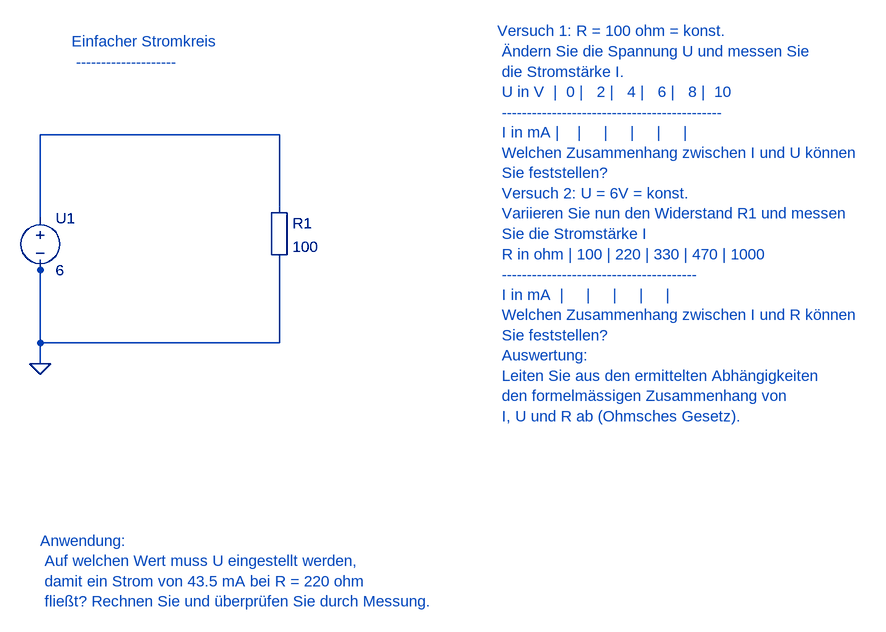
[diagram p0: schematic 1_1_1_Stromkreis.asc]
1_1_1_Stromkreis.asc, the LTspice schematic file:
Version 4
SHEET 1 880 680
WIRE 160 480 160 464
WIRE 160 624 160 592
WIRE 160 592 160 464
WIRE 528 464 528 592
WIRE 528 592 160 592
WIRE 528 384 528 272
WIRE 528 272 160 272
WIRE 160 272 160 400
FLAG 160 624 0
SYMBOL voltage 160 384 R0
SYMATTR InstName U1
SYMATTR Value 6
SYMBOL Misc\EuropeanResistor 512 368 R0
SYMATTR InstName R1
SYMATTR Value 100
TEXT 208 128 Left 2 ;Einfacher Stromkreis \n --------------------
TEXT 864 112 Left 2 ;Versuch 1: R = 100 ohm = konst. \n Ändern Sie die Spannung U und messen Sie \n die Stromstärke I. \n U in V  |  0 |   2 |   4 |   6 |   8 |  10 \n -------------------------------------------- \n I in mA |    |     |     |     |     | \n Welchen Zusammenhang zwischen I und U können \n Sie feststellen? \n Versuch 2: U = 6V = konst. \n Variieren Sie nun den Widerstand R1 und messen \n Sie die Stromstärke I \n R in ohm | 100 | 220 | 330 | 470 | 1000 \n --------------------------------------- \n I in mA  |     |     |     |     | \n Welchen Zusammenhang zwischen I und R können \n Sie feststellen? \n Auswertung: \n Leiten Sie aus den ermittelten Abhängigkeiten \n den formelmässigen Zusammenhang von \n I, U und R ab (Ohmsches Gesetz).
TEXT 160 896 Left 2 ;Anwendung: \n Auf welchen Wert muss U eingestellt werden, \n damit ein Strom von 43.5 mA bei R = 220 ohm \n fließt? Rechnen Sie und überprüfen Sie durch Messung.

The netlist it stands for:
* 1_1_1_Stromkreis.asc
V§U1 N001 0 6
R1 N001 0 100
* Einfacher Stromkreis
*  --------------------
* Versuch 1: R = 100 ohm = konst.
*  Ändern Sie die Spannung U und messen Sie
*  die Stromstärke I.
*  U in V  |  0 |   2 |   4 |   6 |   8 |  10
*  --------------------------------------------
*  I in mA |    |     |     |     |     |
*  Welchen Zusammenhang zwischen I und U können
*  Sie feststellen?
*  Versuch 2: U = 6V = konst.
*  Variieren Sie nun den Widerstand R1 und messen
*  Sie die Stromstärke I
*  R in ohm | 100 | 220 | 330 | 470 | 1000
*  ---------------------------------------
*  I in mA  |     |     |     |     |
*  Welchen Zusammenhang zwischen I und R können
*  Sie feststellen?
*  Auswertung:
*  Leiten Sie aus den ermittelten Abhängigkeiten
*  den formelmässigen Zusammenhang von
*  I, U und R ab (Ohmsches Gesetz).
* Anwendung:
*  Auf welchen Wert muss U eingestellt werden,
*  damit ein Strom von 43.5 mA bei R = 220 ohm
*  fließt? Rechnen Sie und überprüfen Sie durch Messung.
.backanno
.end